# Altium schematic sheet 01_模块结构图.SchDoc
size A4; DocumentNumber: 1; SheetNumber: 1; SheetTotal: 4
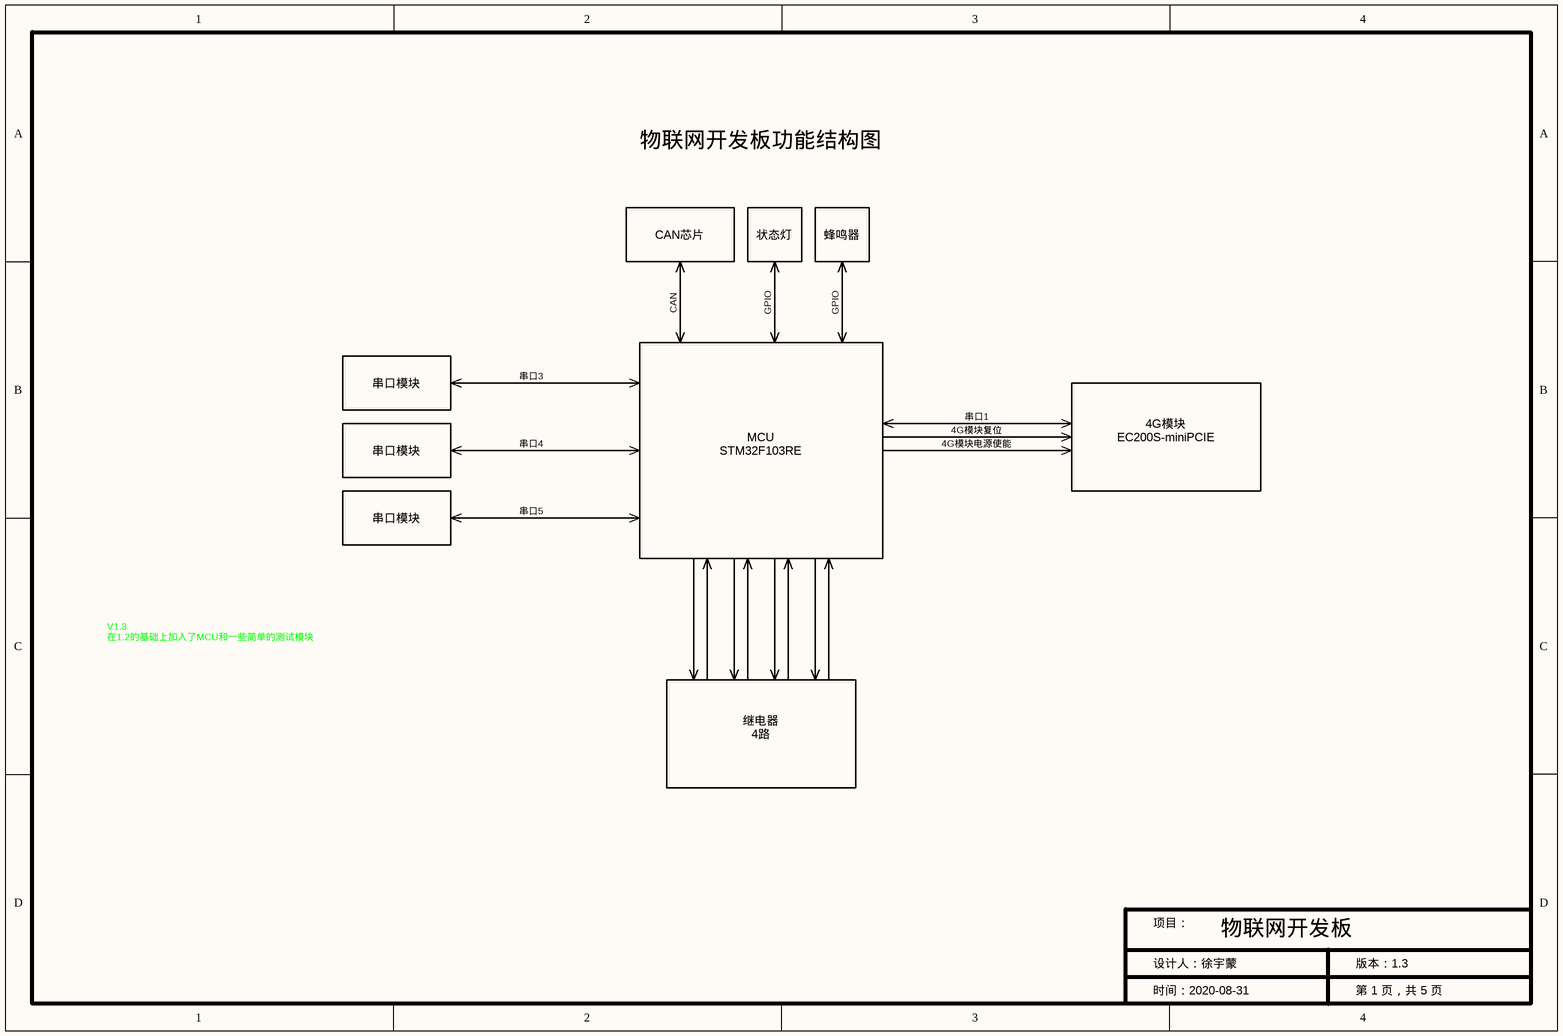
[diagram p0: 01_模块结构图.SchDoc]

## Notes on the sheet
- 物联网开发板功能结构图
- CAN芯片
- 状态灯
- 蜂鸣器
- CAN
- GPIO
- 串口模块
- 串口3
- 串口4
- MCU
- STM32F103RE
- 串口1
- 4G模块复位
- 4G模块电源使能
- 4G模块
- EC200S-miniPCIE
- 串口5
- V1.3
  在1.2的基础上加入了MCU和一些简单的测试模块
- 继电器
- 4路
- 项目：
- 物联网开发板
- 时间：2020-08-31
- 设计人：徐宇蒙
- 第 1 页，共 5 页
- 版本：1.3